# EAGLE design BTX (EAGLE 6.2)
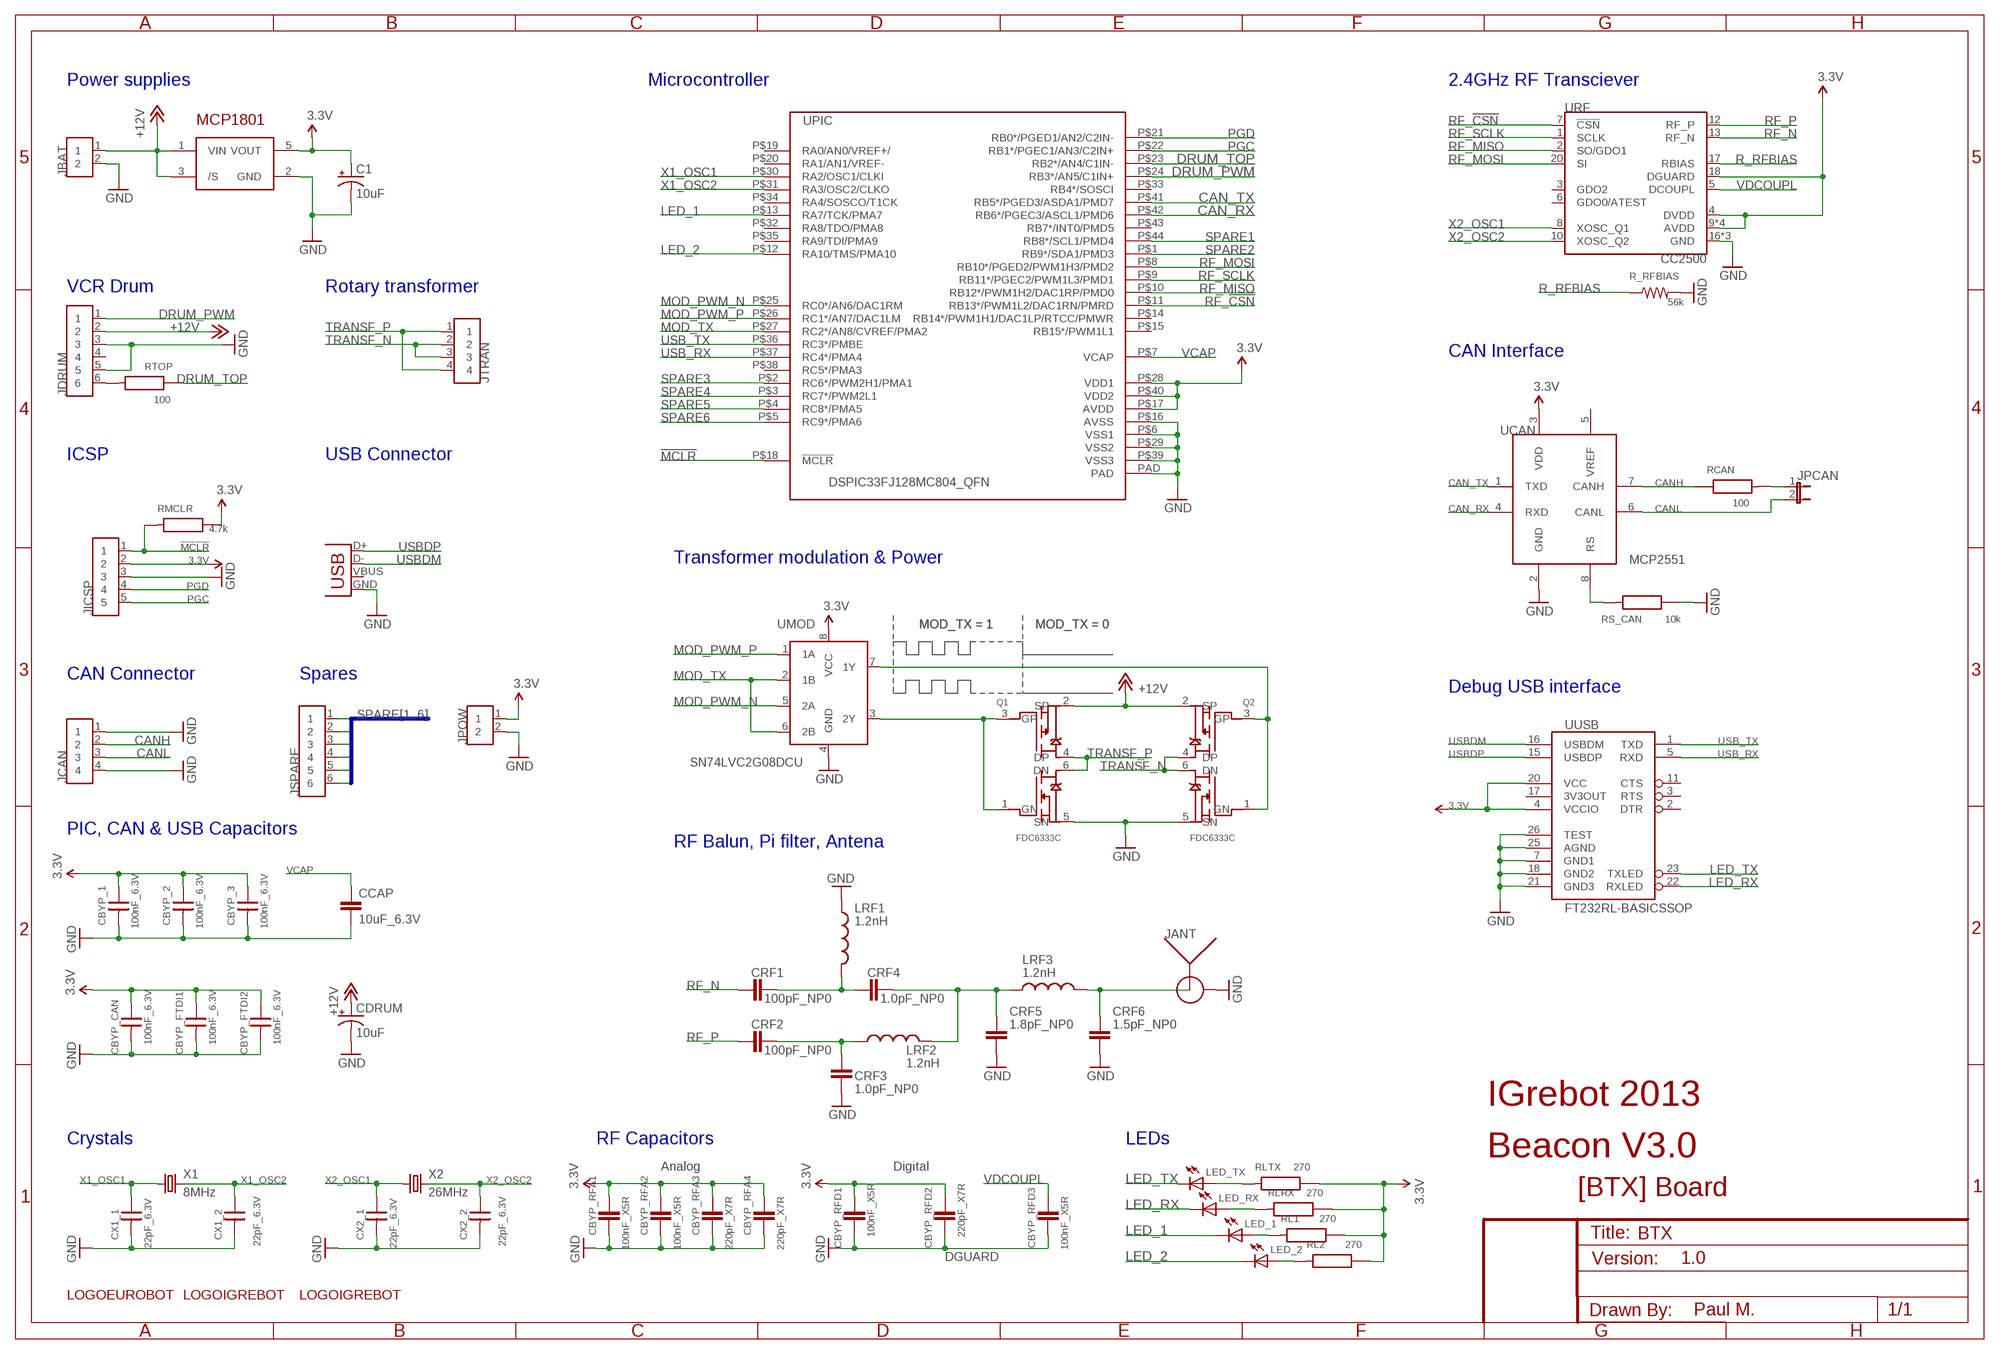
[diagram p0: schematic, sheet 1]

## Parts
C1  10uF  CAP_POLC  [PANASONIC_C]
CBYP_1  100nF_6.3V  C0603  [R0603]
CBYP_2  100nF_6.3V  C0603  [R0603]
CBYP_3  100nF_6.3V  C0603  [R0603]
CBYP_CAN  100nF_6.3V  C0603  [R0603]
CBYP_FTDI1  100nF_6.3V  C0603  [R0603]
CBYP_FTDI2  100nF_6.3V  C0603  [R0603]
CBYP_RFA1  100nF_X5R  CAP0402-CAP  [0402-CAP]
CBYP_RFA2  100nF_X5R  CAP0402-CAP  [0402-CAP]
CBYP_RFA3  220pF_X7R  CAP0402-CAP  [0402-CAP]
CBYP_RFA4  220pF_X7R  CAP0402-CAP  [0402-CAP]
CBYP_RFD1  100nF_X5R  CAP0402-CAP  [0402-CAP]
CBYP_RFD2  220pF_X7R  CAP0402-CAP  [0402-CAP]
CBYP_RFD3  100nF_X5R  CAP0402-CAP  [0402-CAP]
CCAP  10uF_6.3V  CAP1206  [1206]
CDRUM  10uF  CAP_POLC  [PANASONIC_C]
CRF1  100pF_NP0  CAP0402-CAP  [0402-CAP]
CRF2  100pF_NP0  CAP0402-CAP  [0402-CAP]
CRF3  1.0pF_NP0  CAP0402-CAP  [0402-CAP]
CRF4  1.0pF_NP0  CAP0402-CAP  [0402-CAP]
CRF5  1.8pF_NP0  CAP0402-CAP  [0402-CAP]
CRF6  1.5pF_NP0  CAP0402-CAP  [0402-CAP]
CX1_1  22pF_6.3V  C0603  [R0603]
CX1_2  22pF_6.3V  C0603  [R0603]
CX2_1  22pF_6.3V  C0603  [R0603]
CX2_2  22pF_6.3V  C0603  [R0603]
JANT  ENG_CD_1814400_C1  [SMA-PCB-ANGLE]
JBAT  MULTICOMP_PA001-2  [CON2-5.00]
JCAN  SIL4  [CON4-2.54]
JDRUM  SIL6  [CON6-2.54]
JICSP  SIL5  [CON5-2.54]
JPCAN  JUMPER-2PTH_LOCK  [1X02_LOCK]
JPOW  SIL2  [CON2-2.54]
JSPARE  SIL6  [CON6-2.54]
JTRAN  SIL4  [CON4-2.54]
JUSB  USBSMD  [USB-MINIB]
LED_1  LED0603  [LED-0603]
LED_2  LED0603  [LED-0603]
LED_RX  LED0603  [LED-0603]
LED_TX  LED0603  [LED-0603]
LRF1  1.2nH  INDUCTOR0402  [C0402]
LRF2  1.2nH  INDUCTOR0402  [C0402]
LRF3  1.2nH  INDUCTOR0402  [C0402]
Q1  FDC6333C  [SSOT6]
Q2  FDC6333C  [SSOT6]
R_RFBIAS  56k  RESISTOR0402-RES  [0402-RES]
RCAN  100  R0603  [R0603]
RL1  270  R0603  [R0603]
RL2  270  R0603  [R0603]
RLRX  270  R0603  [R0603]
RLTX  270  R0603  [R0603]
RMCLR  4.7k  R0603  [R0603]
RS_CAN  10k  R0603  [R0603]
RTOP  100  R0603  [R0603]
U$3  LOGOEUROBOT  [LOGO_EUROBOT_1]
U$5  LOGOIGREBOT  [LOGO_IGREBOT]
U$9  LOGOIGREBOT  [LOGO_IGREBOT]
UCAN  MCP2551  [SO-08]
UMOD  SN74LVC2G08DCU  [DCU8]
UPIC  DSPIC33FJ128MC804_QFN  [QFN44-8X8]
UREG  MCP1801  [SOT23-5L]
URF  CC2500  [QFN20-0.5]
UUSB  FT232RL-BASICSSOP  [SSOP28DB]
X1  8MHz  XTAL4.8_1.8  [XTAL_4.9-1.8]
X2  26MHz  XTAL4.8_1.8  [XTAL_4.9-1.8]

## Nets
3.3V: C1.+ CBYP_1.1 CBYP_2.1 CBYP_3.1 CBYP_CAN.1 CBYP_FTDI1.1 CBYP_FTDI2.1 CBYP_RFA1.2 CBYP_RFA2.2 CBYP_RFA3.2 CBYP_RFA4.2 CBYP_RFD1.2 CBYP_RFD2.2 JICSP.2 JPOW.1 RL1.1 RL2.1 RLRX.1 RLTX.1 RMCLR.1 UCAN.3(VDD) UMOD.8(VCC) UPIC.P$17(AVDD) UPIC.P$28(VDD1) UPIC.P$40(VDD2) UREG.5(VOUT) URF.4(DVDD) URF.9(AVDD) URF.11(AVDD) URF.14(AVDD) URF.15(AVDD) URF.18(DGUARD) UUSB.4(VCCIO) UUSB.20(VCC)
!MCLR!: JICSP.1 RMCLR.2 UPIC.P$18(!MCLR)
+12V: CDRUM.+ JBAT.1 JDRUM.2 Q1.2(SP) Q2.2(SP) UREG.1(VIN) UREG.3(/S)
CAN_RX: UCAN.4(RXD) UPIC.P$42(RB6*/PGEC3/ASCL1/PMD6)
CAN_TX: UCAN.1(TXD) UPIC.P$41(RB5*/PGED3/ASDA1/PMD7)
CANH: JCAN.2 RCAN.1 UCAN.7(CANH)
CANL: JCAN.3 JPCAN.2 UCAN.6(CANL)
DRUM_PWM: JDRUM.1 UPIC.P$24(RB3*/AN5/C1IN+)
DRUM_TOP: RTOP.1 UPIC.P$23(RB2*/AN4/C1IN-)
GND: C1.- CBYP_1.2 CBYP_2.2 CBYP_3.2 CBYP_CAN.2 CBYP_FTDI1.2 CBYP_FTDI2.2 CBYP_RFA1.1 CBYP_RFA2.1 CBYP_RFA3.1 CBYP_RFA4.1 CBYP_RFD1.1 CBYP_RFD2.1 CBYP_RFD3.1 CCAP.2 CDRUM.- CRF3.1 CRF5.1 CRF6.1 CX1_1.2 CX1_2.2 CX2_1.2 CX2_2.2 JANT.B1(B) JANT.B2(B) JANT.B3(B) JANT.B4(B) JBAT.2 JCAN.1 JCAN.4 JDRUM.3 JDRUM.5 JICSP.3 JPOW.2 JUSB.GND LRF1.1 Q1.5(SN) Q2.5(SN) R_RFBIAS.2 RS_CAN.1 UCAN.2(GND) UMOD.4(GND) UPIC.P$6(VSS1) UPIC.P$16(AVSS) UPIC.P$29(VSS2) UPIC.P$39(VSS3) UPIC.PAD UREG.2(GND) URF.16(GND) URF.19(GND) URF.PAD(GND) UUSB.7(GND1) UUSB.18(GND2) UUSB.21(GND3) UUSB.25(AGND) UUSB.26(TEST)
LED_1: LED_1.C UPIC.P$13(RA7/TCK/PMA7)
LED_2: LED_2.C UPIC.P$12(RA10/TMS/PMA10)
LED_RX: LED_RX.C UUSB.22(RXLED)
LED_TX: LED_TX.C UUSB.23(TXLED)
MOD_N: Q1.1(GN) Q1.3(GP) UMOD.3(2Y)
MOD_P: Q2.1(GN) Q2.3(GP) UMOD.7(1Y)
MOD_PWM_N: UMOD.5(2A) UPIC.P$25(RC0*/AN6/DAC1RM)
MOD_PWM_P: UMOD.1(1A) UPIC.P$26(RC1*/AN7/DAC1LM)
MOD_TX: UMOD.2(1B) UMOD.6(2B) UPIC.P$27(RC2*/AN8/CVREF/PMA2)
N$1: CRF1.2 CRF4.2 LRF1.2
N$2: LED_TX.A RLTX.2
N$3: CRF2.2 CRF3.2 LRF2.1
N$4: CRF4.1 CRF5.2 LRF2.2 LRF3.1
N$5: RS_CAN.2 UCAN.8(RS)
N$6: JPCAN.1 RCAN.2
N$7: CRF6.2 JANT.A LRF3.2
N$8: LED_RX.A RLRX.2
N$9: LED_1.A RL1.2
N$10: LED_2.A RL2.2
PGC: JICSP.5 UPIC.P$22(RB1*/PGEC1/AN3/C2IN+)
PGD: JICSP.4 UPIC.P$21(RB0*/PGED1/AN2/C2IN-)
R_RFBIAS: R_RFBIAS.1 URF.17(RBIAS)
RF_!CSN!: UPIC.P$11(RB13*/PWM1L2/DAC1RN/PMRD) URF.7(!CSN!)
RF_MISO: UPIC.P$10(RB12*/PWM1H2/DAC1RP/PMD0) URF.2(SO/GDO1)
RF_MOSI: UPIC.P$8(RB10*/PGED2/PWM1H3/PMD2) URF.20(SI)
RF_N: CRF1.1 URF.13(RF_N)
RF_P: CRF2.1 URF.12(RF_P)
RF_SCLK: UPIC.P$9(RB11*/PGEC2/PWM1L3/PMD1) URF.1(SCLK)
RTOP: JDRUM.6 RTOP.2
SPARE1: JSPARE.1 UPIC.P$44(RB8*/SCL1/PMD4)
SPARE2: JSPARE.2 UPIC.P$1(RB9*/SDA1/PMD3)
SPARE3: JSPARE.3 UPIC.P$2(RC6*/PWM2H1/PMA1)
SPARE4: JSPARE.4 UPIC.P$3(RC7*/PWM2L1)
SPARE5: JSPARE.5 UPIC.P$4(RC8*/PMA5)
SPARE6: JSPARE.6 UPIC.P$5(RC9*/PMA6)
TRANSF_N: JTRAN.2 JTRAN.3 Q2.4(DP) Q2.6(DN)
TRANSF_P: JTRAN.1 JTRAN.4 Q1.4(DP) Q1.6(DN)
USB_RX: UPIC.P$37(RC4*/PMA4) UUSB.5(RXD)
USB_TX: UPIC.P$36(RC3*/PMBE) UUSB.1(TXD)
USBDM: JUSB.D- UUSB.16(USBDM)
USBDP: JUSB.D+ UUSB.15(USBDP)
VCAP: CCAP.1 UPIC.P$7(VCAP)
VDCOUPL: CBYP_RFD3.2 URF.5(DCOUPL)
X1_OSC1: CX1_1.1 UPIC.P$30(RA2/OSC1/CLKI) X1.P$1
X1_OSC2: CX1_2.1 UPIC.P$31(RA3/OSC2/CLKO) X1.P$2
X2_OSC1: CX2_1.1 URF.8(XOSC_Q1) X2.P$1
X2_OSC2: CX2_2.1 URF.10(XOSC_Q2) X2.P$2
Unconnected: JDRUM.4 JUSB.VBUS UCAN.5(VREF) UPIC.P$14(RB14*/PWM1H1/DAC1LP/RTCC/PMWR) UPIC.P$15(RB15*/PWM1L1) UPIC.P$19(RA0/AN0/VREF+/) UPIC.P$20(RA1/AN1/VREF-) UPIC.P$32(RA8/TDO/PMA8) UPIC.P$33(RB4*/SOSCI) UPIC.P$34(RA4/SOSCO/T1CK) UPIC.P$35(RA9/TDI/PMA9) UPIC.P$38(RC5*/PMA3) UPIC.P$43(RB7*/INT0/PMD5) URF.3(GDO2) URF.6(GDO0/ATEST) UUSB.2(DTR) UUSB.3(RTS) UUSB.11(CTS) UUSB.17(3V3OUT)

## Buses
SPARE[1..6]

## Notes on the sheet
- Power supplies | Microcontroller | 2.4GHz RF Transciever
- VCR Drum | Rotary transformer
- CAN Interface
- ICSP | USB Connector
- Transformer modulation & Power
- MOD_TX = 1 | MOD_TX = 1 | MOD_TX = 0 | MOD_TX = 0
- CAN Connector | Spares
- Debug USB interface
- PIC, CAN & USB Capacitors
- RF Balun, Pi filter, Antena
- IGrebot 2013
- Crystals | RF Capacitors | LEDs
- Beacon V3.0
- Analog | Digital
- [BTX] Board
- DGUARD | 1.0
- Paul M.

## Library data of the parts
C1 CDRUM = SparkFun-Passives:CAP_POL: Capacitor Polarized These are standard SMD and PTH capacitors. Normally 10uF, 47uF, and 100uF in electrolytic and tantalum varieties. Always verify the external diameter of the through hole cap, it varies with capacity, voltage, and manufacturer. The EIA devices should be standard.
CBYP_1-CBYP_3 CBYP_CAN CBYP_FTDI1 CBYP_FTDI2 CX1_1 CX1_2 CX2_1 CX2_2 = 0SBLib:C
CBYP_RFA1-CBYP_RFA4 CBYP_RFD1-CBYP_RFD3 CRF1-CRF6 = SparkFun-Passives:CAP: Capacitor Standard 0603 ceramic capacitor, and 0.1" leaded capacitor.
CCAP = SparkFun:CAP: Capacitor Standard 0603 ceramic capacitor, and 0.1" leaded capacitor.
JANT = lib_paul_v6:ENG_CD_1814400_C1
JBAT = lib_paul_v6:MULTICOMP_PA001-2
JCAN JTRAN = lib_paul_v6:SIL4
JDRUM JSPARE = lib_paul_v6:SIL6
JICSP = lib_paul_v6:SIL5
JPCAN = SparkFun-Passives:JUMPER-2: Jumper Basic 0.1" spaced jumper. Use with breakaway headers.
JPOW = lib_paul_v6:SIL2
JUSB = SparkFun:USB: USB Connectors USB-B-PTH is fully proven SKU : PRT-00139 USB-miniB is fully proven SKU : PRT-00587 USB-A-PCB is untested. USB-A-H is throughly reviewed, but untested. Spark Fun Electronics SKU : PRT-00437 USB-B-SMT is throughly reviewed, but untested. Needs silkscreen touching up. USB-A-S has not been used/tested USB-MB-H has not been used/tested
LED_1 LED_2 LED_RX LED_TX = SparkFun:LED: LEDs Standard schematic elements and footprints for 5mm, 3mm, 1206, and 0603 sized LEDs. 5mm - Spark Fun Electronics SKU : COM-00529 (and others)
LRF1-LRF3 = SparkFun-Passives:INDUCTOR: Inductors Basic Inductor/Choke - 0603 and 1206. Footprints are not proven and vary greatly between part numbers.
Q1 Q2 = lib_paul_v6:FDC6333C
R_RFBIAS = SparkFun-Passives:RESISTOR: Resistor Basic schematic elements and footprints for 0603, 1206, and PTH resistors.
RCAN RL1 RL2 RLRX RLTX RMCLR RS_CAN RTOP = 0SBLib:R
U$3 U$5 U$9 = 0SBLib:LOGO
UCAN = 0SBLib:MCP2551: High-Speed CAN Transceiver
UMOD = lib_paul_v6:SN74LVC2G08DCU
UPIC = 0SBLib:DSPIC33FJ128MC804: High-Performance,16-bit Digital Signal Controller
UREG = 0SBLib:MCP1801
URF = lib_paul_v6:CC2500
UUSB = SparkFun:FT232RL-BASIC: USB UART This is the simplified version of the FT232RL unit. Only what you need, nothing you don't. Spark Fun Electronics SKU : COM-00650
X1 X2 = 0SBLib:XTAL

## Board
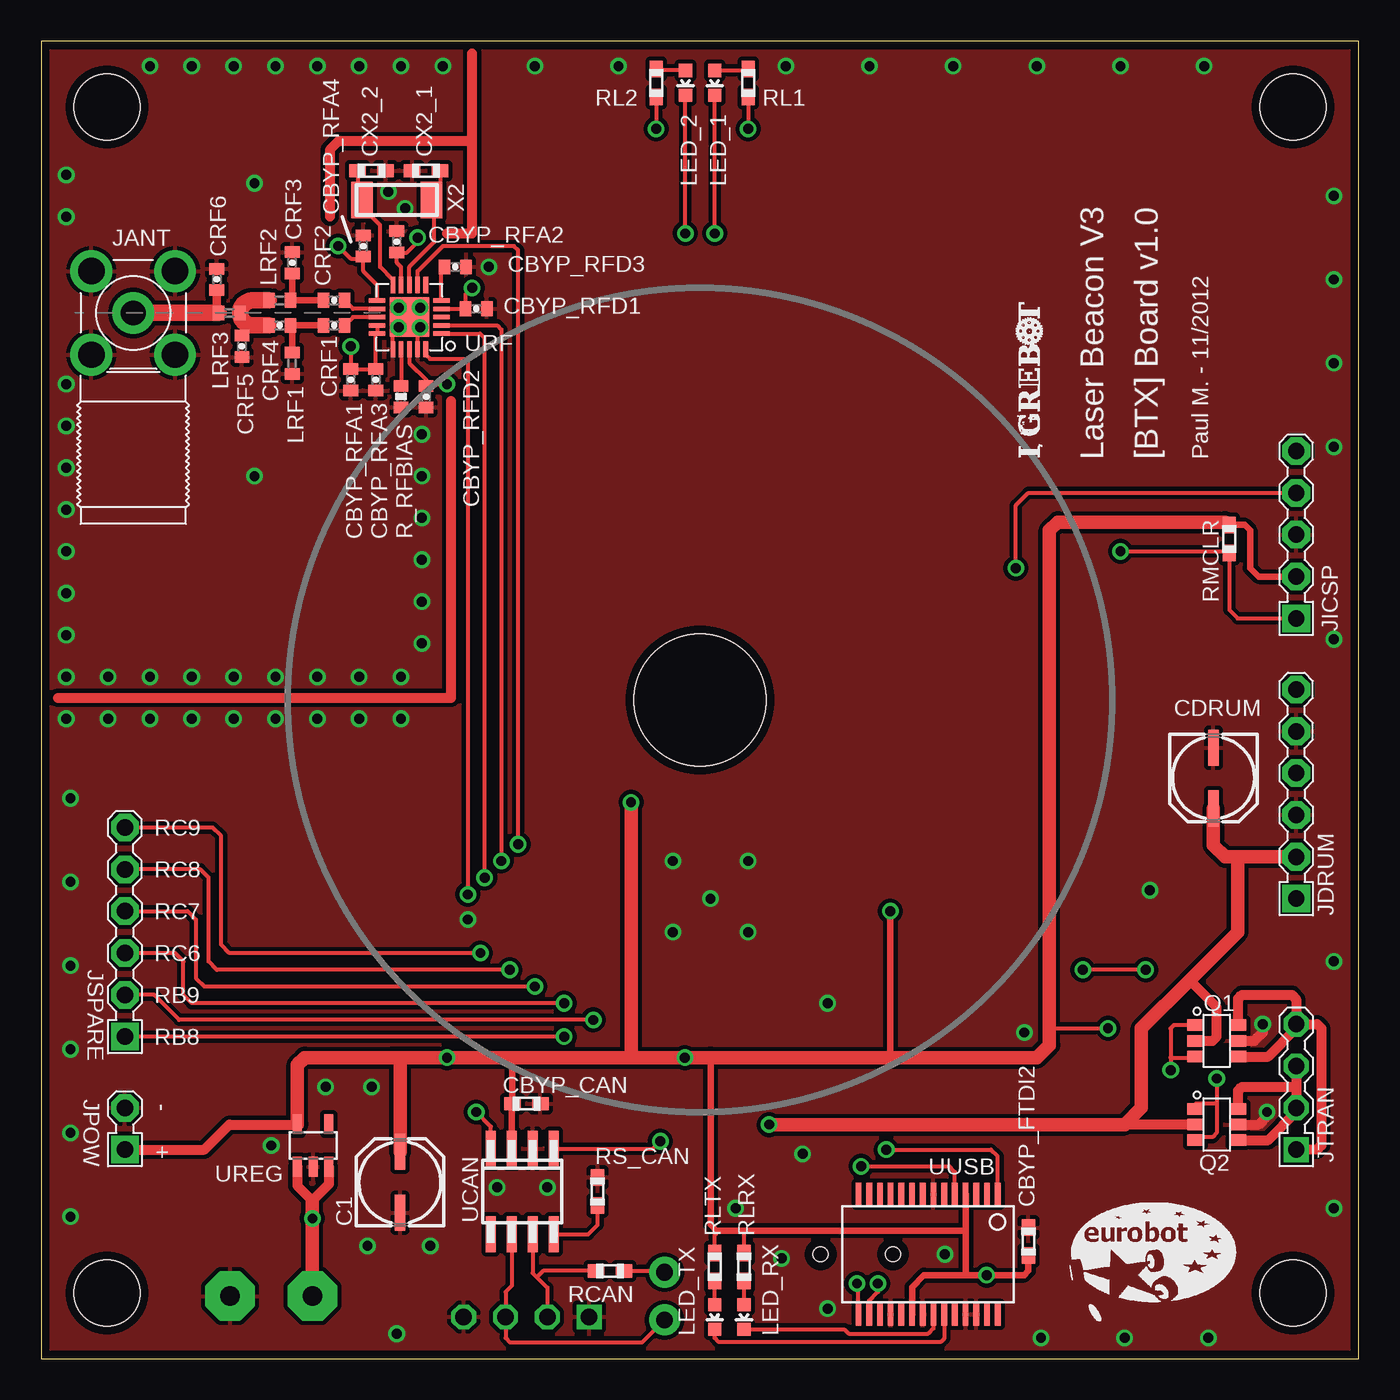
[diagram p1: board, top side]
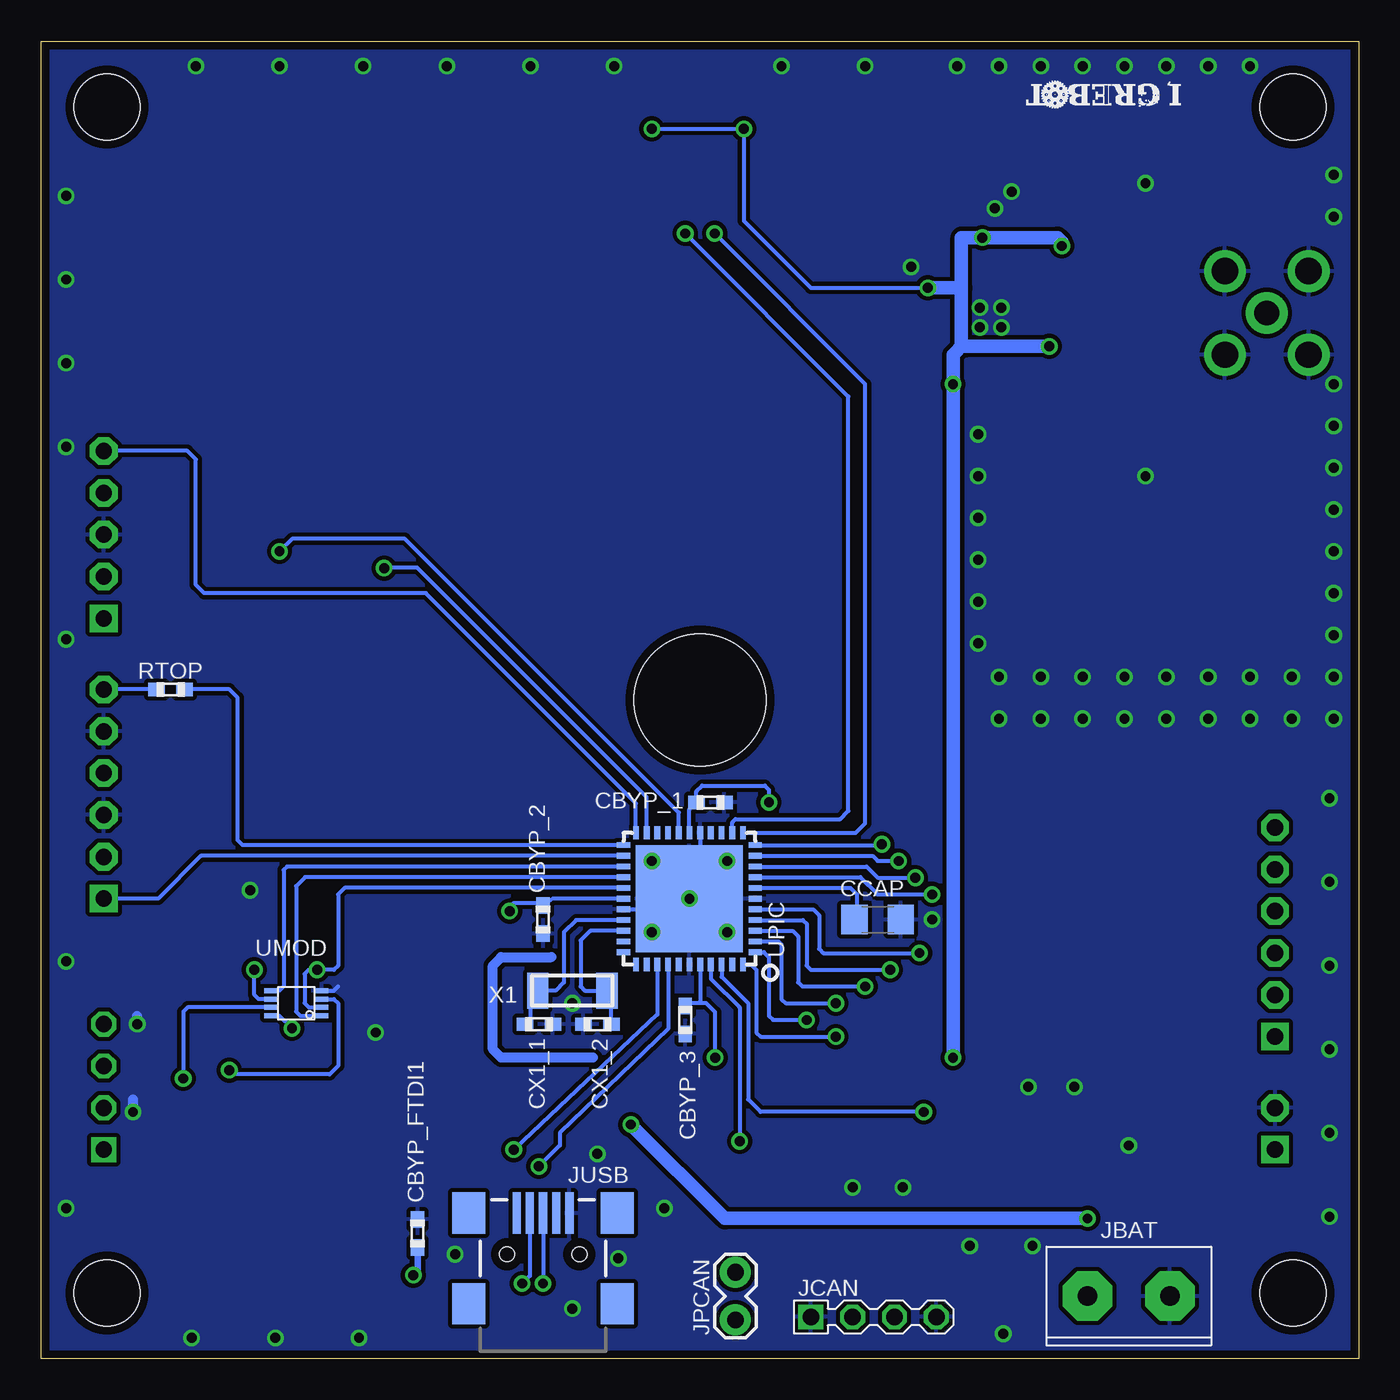
[diagram p2: board, bottom side, seen from below]

Size 80 x 80 mm. Coordinates in mm from the lower left corner, seen from the top.
Outline: 0,0 80,0 80,80 0,80 0,0
Copper layers (1*16): Top 0.035mm / dielectric 1.5mm / Bottom 0.035mm
Design rules: minimum track width 10mil, minimum drill 0.6mm, track to track 8mil, track to pad 8mil, pad to pad 7.5mil, via to via 8mil, smd to smd 7.5mil, copper to edge 20mil, drill to drill 8mil, minimum pad ring 10mil, minimum via ring 8mil, stop-mask expansion 4mil, vias tented up to drill 0mil, thermal gap 10mil
Holes 4 mm at 4,4 4,76 76,76 76,4
Holes 8 mm at 40,40

### Footprints (pad centres in the part's own frame; a part is rotated, then mirrored left to right if it is on the bottom)
PANASONIC_C = smd 2.2 x 0.65: + 1.9,-0.2; - -1.8,-0.2
R0603 = smd 1 x 0.8: 1 -0.85,0; 2 0.85,0
0402-CAP = smd 0.7 x 0.9: 1 -0.65,0; 2 0.65,0
1206 = smd 1.6 x 1.8: 1 -1.4,0; 2 1.4,0
SMA-PCB-ANGLE = drill 1.5 pad 2.54: A 0,0 | drill 1.6 pad 2.54: B1 -2.54,2.54; B2 2.54,2.54; B3 2.54,-2.54; B4 -2.54,-2.54
CON2-5.00 = drill 1.2 pad 3 octagon: 1 -2.5,0; 2 2.5,0
CON4-2.54 = drill 1 square: 1 -3.81,0 | drill 1 octagon: 2 -1.27,0; 3 1.27,0; 4 3.81,0
CON6-2.54 = drill 1 pad 1.676 square: 1 -6.35,0 | drill 1 pad 1.676 octagon: 2 -3.81,0; 3 -1.27,0; 4 1.27,0; 5 3.81,0; 6 6.35,0
CON5-2.54 = drill 1 pad 1.676 square: 1 -5.08,0 | drill 1 pad 1.676 octagon: 2 -2.54,0; 3 0,0; 4 2.54,0; 5 5.08,0
1X02_LOCK = drill 1.016 pad 1.88: 1 -0.178,0; 2 2.718,0
CON2-2.54 = drill 1 pad 1.676 square: 1 -1.27,0 | drill 1 pad 1.676 octagon: 2 1.27,0
USB-MINIB = smd 2.5 x 0.5: D+ 2.5,0; D- 2.5,0.8; GND 2.5,-1.6; ID 2.5,-0.8; VBUS 2.5,1.6 | smd 2.5 x 2: MTN1 -3,4.5; MTN2 2.5,4.5; MTN3 -3,-4.5; MTN4 2.5,-4.5 | hole 0.9: 0,2.2; 0,-2.2
LED-0603 = smd 0.8 x 0.8: A 0,-0.75; C 0,0.75
C0402 = smd 0.7 x 0.9: 1 -0.65,0; 2 0.65,0
SSOT6 = smd 0.7 x 1: 1 -0.95,-1.3; 2 0,-1.3; 3 0.95,-1.3; 4 0.95,1.3; 5 0,1.3; 6 -0.95,1.3
0402-RES = smd 0.7 x 0.9: 1 -0.65,0; 2 0.65,0
SO-08 = smd 0.6 x 2.2: 1 -1.905,-2.6; 2 -0.635,-2.6; 3 0.635,-2.6; 4 1.905,-2.6; 5 1.905,2.6; 6 0.635,2.6; 7 -0.635,2.6; 8 -1.905,2.6
DCU8 = smd 0.3 x 0.8: 1 -0.75,-1.55; 2 -0.25,-1.55; 3 0.25,-1.55; 4 0.75,-1.55; 5 0.75,1.55; 6 0.25,1.55; 7 -0.25,1.55; 8 -0.75,1.55
QFN44-8X8 = smd 0.8 x 0.35: P$1 -4,3.25; P$2 -4,2.6; P$3 -4,1.95; P$4 -4,1.3; P$5 -4,0.65; P$6 -4,0; P$7 -4,-0.65; P$8 -4,-1.3; P$9 -4,-1.95; P$10 -4,-2.6; P$11 -4,-3.25; P$23 4,-3.25; P$24 4,-2.6; P$25 4,-1.95; P$26 4,-1.3; P$27 4,-0.65; P$28 4,0; P$29 4,0.65; P$30 4,1.3; P$31 4,1.95; P$32 4,2.6; P$33 4,3.25 | smd 0.35 x 0.8: P$12 -3.25,-4; P$13 -2.6,-4; P$14 -1.95,-4; P$15 -1.3,-4; P$16 -0.65,-4; P$17 0,-4; P$18 0.65,-4; P$19 1.3,-4; P$20 1.95,-4; P$21 2.6,-4; P$22 3.25,-4; P$34 3.25,4; P$35 2.6,4; P$36 1.95,4; P$37 1.3,4; P$38 0.65,4; P$39 0,4; P$40 -0.65,4; P$41 -1.3,4; P$42 -1.95,4; P$43 -2.6,4; P$44 -3.25,4 | smd 6.5 x 6.5: PAD 0,0
SOT23-5L = smd 0.55 x 1.2: 1 -0.95,-1.3; 2 0,-1.3; 3 0.95,-1.3; 4 0.95,1.3; 5 -0.95,1.3
QFN20-0.5 = smd 0.28 x 1: 1 -1,-1.95; 2 -0.5,-1.95; 3 0,-1.95; 4 0.5,-1.95; 5 1,-1.95; 11 1,1.95; 12 0.5,1.95; 13 0,1.95; 14 -0.5,1.95; 15 -1,1.95 | smd 1 x 0.28: 6 1.95,-1; 7 1.95,-0.5; 8 1.95,0; 9 1.95,0.5; 10 1.95,1; 16 -1.95,1; 17 -1.95,0.5; 18 -1.95,0; 19 -1.95,-0.5; 20 -1.95,-1 | smd 2.4 x 2.4: PAD 0,0
SSOP28DB = smd 0.348 x 1.397: 1 -4.225,-3.656; 2 -3.575,-3.656; 3 -2.925,-3.656; 4 -2.275,-3.656; 5 -1.625,-3.656; 6 -0.975,-3.656; 7 -0.325,-3.656; 8 0.325,-3.656; 9 0.975,-3.656; 10 1.625,-3.656; 11 2.275,-3.656; 12 2.925,-3.656; 13 3.575,-3.656; 14 4.225,-3.656; 15 4.225,3.656; 16 3.575,3.656; 17 2.925,3.656; 18 2.275,3.656; 19 1.625,3.656; 20 0.975,3.656; 21 0.325,3.656; 22 -0.325,3.656; 23 -0.975,3.656; 24 -1.625,3.656; 25 -2.275,3.656; 26 -2.925,3.656; 27 -3.575,3.656; 28 -4.225,3.656
XTAL_4.9-1.8 = smd 1.3 x 2.2: P$1 -2.1,0; P$2 2.1,0

### Placement (x,y rotation side)
C1  21.59,10.67 90 top
CBYP_1  39.37,33.78 0 bottom
CBYP_2  49.53,26.67 270 bottom
CBYP_3  40.89,20.57 270 bottom
CBYP_CAN  29.46,15.49 0 top
CBYP_FTDI1  57.15,7.62 90 bottom
CBYP_FTDI2  59.94,7.11 90 top
CBYP_RFA1  18.8,59.44 90 top
CBYP_RFA2  21.59,67.82 270 top
CBYP_RFA3  20.32,59.44 90 top
CBYP_RFA4  19.56,67.56 270 top
CBYP_RFD1  26.42,63.75 180 top
CBYP_RFD2  23.37,58.42 90 top
CBYP_RFD3  25.15,66.29 180 top
CCAP  29.21,26.67 0 bottom
CDRUM  71.37,35.31 270 top
CRF1  17.78,62.74 180 top
CRF2  17.78,64.26 180 top
CRF3  15.24,66.55 270 top
CRF4  14.48,62.74 0 top
CRF5  12.19,61.47 90 top
CRF6  10.67,65.53 270 top
CX1_1  49.78,20.32 0 bottom
CX1_2  46.23,20.32 180 bottom
CX2_1  23.37,72.14 180 top
CX2_2  20.07,72.14 0 top
JANT  5.59,63.5 270 top
JBAT  13.97,3.81 0 bottom
JCAN  29.46,2.54 0 bottom
JDRUM  76.2,34.29 90 top
JICSP  76.2,50.04 90 top
JPCAN  37.85,5.08 270 bottom
JPOW  5.08,13.97 90 top
JSPARE  5.08,25.91 90 top
JTRAN  76.2,16.51 90 top
JUSB  49.53,6.35 90 bottom
LED_1  40.89,77.47 180 top
LED_2  39.12,77.47 180 top
LED_RX  42.67,2.54 180 top
LED_TX  40.89,2.54 180 top
LRF1  15.24,60.45 90 top
LRF2  14.48,64.26 180 top
LRF3  11.43,63.5 180 top
Q1  71.37,19.3 270 top
Q2  71.37,14.22 270 top
R_RFBIAS  21.84,58.42 270 top
RCAN  34.54,5.33 0 top
RL1  42.93,77.47 90 top
RL2  37.34,77.47 90 top
RLRX  42.67,5.59 270 top
RLTX  40.89,5.59 270 top
RMCLR  72.14,49.78 270 top
RS_CAN  33.78,10.16 270 top
RTOP  72.14,40.64 180 bottom
U$3  61.98,1.78 0 top
U$5  60.96,54.61 90 top
U$9  10.67,77.72 180 bottom
UCAN  29.21,10.16 180 top
UMOD  64.52,21.59 90 bottom
UPIC  40.64,27.94 180 bottom
UREG  16.51,12.95 0 top
URF  22.35,63.25 90 top
UUSB  53.85,6.35 180 top
X1  47.75,22.35 0 bottom
X2  21.59,70.36 180 top

### Tracks (layer width: path | path; a pad name or v marks a point on that pad's centre or on a via)
3.3V  (via drill 0.6)
  Top 0.254: URF.9 21.85,66.29 21.59,66.55 CBYP_RFA2.2 22.21,67.17 22.86,67.82 v22.86,68.07 | URF.18 22.35,60.45 23.37,59.44 23.37,59.18 | 23.37,59.18 CBYP_RFD2.2 | URF.14 URF.15 20.32,62.16 CBYP_RFA3.2 CBYP_RFA1.2 v18.8,61.47 | v18.03,67.56 18.8,66.8 19.7,66.8 CBYP_RFA4.2 19.56,66.04 20.4,65.2 URF.11 | 23.37,59.18 v24.64,59.18 | RL1.1 v42.93,74.68 | RL2.1 v37.34,74.68 | RLTX.1 40.89,7.52 41.15,7.77 | RLRX.1 42.67,7.77 | 61.21,20.07 v64.77,20.07 | 51.54,27.15 v51.56,27.18 | URF.4 25.76,63.75 CBYP_RFD1.2 25.77,64.63 v26.16,65.02
  Top 0.406: UCAN.3 28.57,15.46 CBYP_CAN.1 28.61,18.12 28.45,18.29 | UUSB.20 52.87,4.36 53.59,5.08 56.13,5.08 | UUSB.4 56.12,7.77 | 56.12,7.77 56.12,5.09 56.13,5.08 | 56.13,5.08 v57.4,5.08 59.69,5.08 59.94,5.33 CBYP_FTDI2.1 | 56.12,7.77 42.67,7.77 41.15,7.77 41,7.77 40.64,8.13 40.64,18.29 | 51.54,27.15 51.54,18.32 51.56,18.29 | v35.81,33.78 | RMCLR.1 73.06,50.63 73.41,50.29 73.41,48.01 73.91,47.5 JICSP.2
  Top 0.61: JPOW.1 9.91,12.7 11.43,14.22 15.53,14.22 UREG.5
  Top 0.813: 35.81,18.29 28.45,18.29 v24.64,18.29 21.59,18.29 | 35.81,18.29 v39.08,18.29 40.64,18.29 51.56,18.29 60.45,18.29 61.21,19.05 61.21,20.07 61.21,50.29 61.72,50.8 71.88,50.8 72.05,50.71 RMCLR.1 | 35.81,18.29 v35.81,33.78 | UREG.5 15.56,17.85 16,18.29 21.34,18.29 | 21.34,18.29 21.59,18.29 | C1.+ 21.79,18.09 21.59,18.29 | 21.34,18.29
  Bottom 0.254: UPIC.P$28 48.93,27.94 CBYP_2.1 49.7,27.69 51.31,27.69 51.56,27.43 v51.56,27.18 | v42.93,74.68 v37.34,74.68 37.34,69.09 33.27,65.02 v26.16,65.02 | v64.77,20.07 65.53,20.83 66.05,20.83 UMOD.8 | v39.08,18.29 39.08,21.05 39.62,21.59 39.88,21.59 | 39.88,21.59 40.73,21.59 CBYP_3.1 | UPIC.P$40 39.99,21.7 39.88,21.59 | UPIC.P$17 40.64,33.36 CBYP_1.1 40.22,34.46 39.88,34.8 36.07,34.8 35.81,34.54 v35.81,33.78
  Bottom 0.406: 23.88,61.47 24,61.59 24.13,61.72 | CBYP_FTDI1.1 57.15,5.33 v57.4,5.08
  Bottom 0.813: v18.03,67.56 18.03,67.82 18.29,68.07 v22.86,68.07 24.13,68.07 24.13,65.02 | v18.8,61.47 23.88,61.47 | 24.13,61.72 24.13,65.02 | v24.64,59.18 24.64,60.96 24,61.59 | v26.16,65.02 24.13,65.02 | v24.64,59.18 | v24.64,59.18 v24.64,18.29
!MCLR!  (via drill 0.6)
  Top 0.254: v65.53,49.02 72.05,49.02 RMCLR.2 72.14,45.47 72.64,44.96 JICSP.1
  Bottom 0.254: UPIC.P$18 41.29,33.16 57.91,49.78 64.77,49.78 v65.53,49.02
+12V  (via drill 0.6)
  Top 0.508: 66.87,18.22 66.8,18.29
  Top 0.61: UREG.1 15.56,10.52 16.47,9.61 17.46,10.6 UREG.3 | Q1.2 71.12,19.3 71.37,19.56 71.37,21.34 69.72,22.99 | Q2.2 65.79,14.22
  Top 0.813: JBAT.1 v16.47,8.52 16.47,9.61 | v44.2,14.22 65.79,14.22 66.8,15.24 66.8,18.29 66.8,20.07 69.72,22.99 72.64,25.91 72.64,30.48 | 72.64,30.48 JDRUM.2 | CDRUM.+ 71.17,31.19 71.88,30.48 72.64,30.48
  Bottom 0.813: v16.47,8.52 38.49,8.52 v44.2,14.22
CAN_RX  (via drill 0.6)
  Top 0.254: UCAN.4 27.3,14.1 v26.42,14.99
  Bottom 0.254: UPIC.P$42 38.69,23.2 37.08,21.59 37.08,15.75 36.32,14.99 v26.42,14.99
CAN_TX  (via drill 0.6)
  Top 0.254: UCAN.1 37.14,12.76 v37.59,13.21
  Bottom 0.254: UPIC.P$41 39.34,23.08 37.59,21.34 v37.59,13.21
CANH
  Top 0.254: UCAN.7 29.84,5.21 30.1,4.95 | 30.1,4.95 30.73,4.32 JCAN.2 | RCAN.1 30.48,5.33 30.1,4.95
CANL
  Top 0.254: UCAN.6 28.57,4.45 28.19,4.06 JCAN.3 28.19,1.27 28.45,1.02 36.5,1.02 JPCAN.2
DRUM_PWM
  Bottom 0.254: UPIC.P$24 70.3,30.54 72.9,27.94 JDRUM.1
DRUM_TOP
  Bottom 0.254: UPIC.P$23 67.77,31.19 68.07,31.5 68.07,40.13 68.58,40.64 RTOP.1
GND  (via drill 0.6)
  Top 0.254: URF.19 22.85,62.47 v23.01,62.63 | URF.16 21.35,62.27 v21.71,62.63
  Top 0.61: Q2.5 73.91,14.22 74.42,14.73 v74.42,14.99 | Q1.5 73.66,19.3 74.17,19.81 v74.17,20.32
  Bottom 0.254: UPIC.P$29 43.32,27.29 | 43.32,27.29 43.18,27.43 | UPIC.P$16 39.99,30.59 39.62,30.23 v38.35,30.23 | 43.32,27.29 43.32,27.07 42.93,26.67 v42.93,25.91 | UMOD.4 62.24,22.34 61.98,22.61
  Bottom 0.61: v74.42,14.99 74.42,15.75 | v74.17,20.32 74.17,20.83
  other vias: 21.71,63.83 23.01,63.83 27.18,66.29 21.08,70.87 22.1,69.85 1.52,41.4 4.06,41.4 6.6,41.4 9.14,41.4 11.68,41.4 14.22,41.4 16.76,41.4 19.3,41.4 21.84,41.4 1.52,38.86 4.06,38.86 6.6,38.86 9.14,38.86 11.68,38.86 14.22,38.86 16.76,38.86 19.3,38.86 21.84,38.86 1.52,43.94 1.52,46.48 1.52,49.02 1.52,51.56 1.52,54.1 1.52,56.64 1.52,59.18 1.52,69.34 1.52,71.88 6.6,78.49 9.14,78.49 11.68,78.49 14.22,78.49 16.76,78.49 19.3,78.49 21.84,78.49 24.38,78.49 23.11,43.43 23.11,45.97 23.11,48.51 23.11,51.05 23.11,53.59 23.11,56.13 12.95,53.59 12.95,71.37 42.93,30.23 38.35,25.91 40.64,27.94 47.75,21.59 60.71,1.27 65.79,1.27 70.87,1.27 78.49,9.14 78.49,24.13 67.31,28.45 78.49,43.69 78.49,55.37 78.49,60.45 78.49,65.53 78.49,70.61 70.61,78.49 21.59,1.52 1.78,8.64 1.78,13.72 1.78,18.8 1.78,23.88 1.78,28.96 1.78,34.04 65.53,78.49 60.45,78.49 55.37,78.49 50.29,78.49 45.21,78.49 35.05,78.49 29.97,78.49 25.91,26.67 54.86,6.35 47.75,3.05 44.96,6.1 42.16,9.14 46.23,12.45 27.69,10.41 30.73,10.41 13.97,12.95 17.27,16.51 20.07,16.51 19.81,6.86 23.62,6.86 59.69,19.81
  pour Bottom (isolate 0.254): 0,80.01 80.01,80.01 80.01,0 0,0
  pour Top (isolate 0.254, rank 4): 0,80.01 80.01,80.01 80.01,0 0,0
LED_1  (via drill 0.6)
  Top 0.254: v40.89,68.33 LED_1.C
  Bottom 0.254: UPIC.P$13 38.04,32.57 37.85,32.77 31.5,32.77 30.99,33.27 30.99,58.42 v40.89,68.33
LED_2  (via drill 0.6)
  Top 0.254: v39.12,68.33 LED_2.C
  Bottom 0.254: UPIC.P$12 30.54,31.94 29.97,32.51 29.97,59.18 v39.12,68.33
LED_RX
  Top 0.254: LED_RX.C 48.76,1.79 49.02,1.52 53.85,1.52 54.17,1.85 UUSB.22
LED_TX
  Top 0.254: UUSB.23 54.82,1.23 54.61,1.02 41.15,1.02 40.89,1.27 LED_TX.C
MOD_N  (via drill 0.6)
  Top 0.254: 68.58,18.29 70.01,18.29 Q1.3 | Q1.1 68.77,20.25 68.58,20.07 68.58,18.29 | 68.58,18.29 v68.58,17.53
  Bottom 0.254: UMOD.3 62.23,21.84 61.98,21.59 61.98,17.78 62.48,17.27 68.33,17.27 v68.58,17.53
MOD_P  (via drill 0.6)
  Top 0.254: v71.37,17.02 71.37,15.49 | 71.37,15.49 71.37,13.72 71.12,13.46 70.14,13.46 Q2.3 | 71.37,15.49 70.14,15.49 | 70.1,15.49 70.14,15.49 | 70.14,15.49 Q2.1
  Bottom 0.254: UMOD.7 71.12,21.34 71.37,21.08 v71.37,17.02
MOD_PWM_N
  Bottom 0.254: UPIC.P$25 65.07,29.89 65.28,29.69 65.28,22.61 65.53,22.35 66.05,22.35 UMOD.5
MOD_PWM_P
  Bottom 0.254: UPIC.P$26 63.98,29.24 64.52,28.7 64.52,21.08 64.26,20.83 62.98,20.83 UMOD.1
MOD_TX  (via drill 0.6)
  Top 0.254: v67.06,23.62 v63.25,23.62
  Bottom 0.254: UPIC.P$27 61.58,28.59 61.98,28.19 61.98,23.88 62.23,23.62 v63.25,23.62 63.75,23.62 64.01,23.37 64.01,21.59 63.75,21.34 UMOD.2 | UMOD.6 66.8,21.84 67.06,22.1 v67.06,23.62
N$1
  Top 0.406: CRF1.2 CRF4.2 15.24,62.74 LRF1.2
N$2
  Top 0.254: LED_TX.A RLTX.2
N$3
  Top 0.406: CRF2.2 LRF2.1 15.24,64.26 CRF3.2
N$4
  Top 0.254: CRF5.2 arc-90 12.81,62.74 12.84,62.74
  Top 1.016: CRF4.1 12.84,62.74 arc-90 LRF3.1 arc-90 12.84,64.26 LRF2.2
N$5
  Top 0.254: UCAN.8 33.21,7.56 33.78,8.13 RS_CAN.2
N$6
  Top 0.254: RCAN.2 37.77,5.33 JPCAN.1
N$7
  Top 0.508: LRF3.2 arc-90 10.67,63.61 CRF6.2
  Top 1.016: JANT.A LRF3.2
N$8
  Top 0.254: LED_RX.A RLRX.2
N$9
  Top 0.254: LED_1.A 42.83,78.22 RL1.2
N$10
  Top 0.254: LED_2.A 37.44,78.22 RL2.2
N$14
  Bottom 0.61: 46.48,18.29 52.07,18.29 52.58,18.8 52.58,23.88 52.07,24.38 49.02,24.38
PGC
  Bottom 0.254: UPIC.P$22 43.89,33.73 56.64,46.48 70.1,46.48 70.61,46.99 70.61,54.61 71.12,55.12 JICSP.5
PGD  (via drill 0.6)
  Top 0.254: v59.18,48.01 59.18,51.82 59.94,52.58 JICSP.4
  Bottom 0.254: UPIC.P$21 43.24,34.1 57.17,48.03 59.16,48.03 v59.18,48.01
R_RFBIAS
  Top 0.254: URF.17 21.85,59.08 R_RFBIAS.1
RF_!CSN!  (via drill 0.6)
  Top 0.254: URF.7 22.85,66.03 24.38,67.56 28.7,67.56 28.96,67.31 v28.96,31.24
  Bottom 0.254: UPIC.P$11 29.01,31.19 v28.96,31.24
RF_MISO  (via drill 0.6)
  Top 0.254: URF.2 27.68,62.75 27.94,62.48 v27.94,30.23
  Bottom 0.254: UPIC.P$10 29.52,30.54 29.21,30.23 v27.94,30.23
RF_MOSI  (via drill 0.6)
  Top 0.254: URF.20 23.35,60.98 23.62,60.71 25.65,60.71 25.91,60.45 v25.91,28.19
  Bottom 0.254: UPIC.P$8 30.26,29.24 29.21,28.19 v25.91,28.19
RF_N
  Top 0.254: URF.13 18.94,63.25 CRF1.1
RF_P
  Top 0.254: URF.12 18.95,63.75 CRF2.1
RF_SCLK  (via drill 0.6)
  Top 0.254: v26.92,29.21 26.92,61.98 26.65,62.25 URF.1
  Bottom 0.254: UPIC.P$9 29.89,29.89 29.21,29.21 v26.92,29.21
RTOP
  Bottom 0.254: RTOP.2 JDRUM.6
SHIELD
  Top 0.61: 26.16,73.91 18.03,73.91 17.53,73.41 17.53,69.34 | 26.16,73.91 26.16,68.33 24.64,68.33 | 26.16,73.91 26.16,79.25
SHIELD2
  Top 0.61: 1.02,40.13 24.89,40.13 24.89,58.17
SPARE1  (via drill 0.6)
  Top 0.254: v31.75,19.56 JSPARE.1
  Bottom 0.254: UPIC.P$44 36.89,23.94 36.58,23.62 36.58,19.81 36.32,19.56 v31.75,19.56
SPARE2  (via drill 0.6)
  Top 0.254: v33.53,20.57 8.38,20.57 6.86,22.1 JSPARE.2
  Bottom 0.254: UPIC.P$1 36.12,24.69 35.81,24.38 35.81,20.83 35.56,20.57 v33.53,20.57
SPARE3  (via drill 0.6)
  Top 0.254: v31.75,21.59 9.14,21.59 8.64,22.1 8.64,24.13 8.13,24.64 JSPARE.3
  Bottom 0.254: UPIC.P$2 35.25,25.34 35.05,25.15 35.05,21.84 34.8,21.59 v31.75,21.59
SPARE4  (via drill 0.6)
  Top 0.254: JSPARE.4 8.89,27.18 9.4,26.67 9.4,23.11 9.91,22.61 v29.97,22.61
  Bottom 0.254: UPIC.P$3 34.37,25.99 34.04,25.65 34.04,22.86 33.78,22.61 v29.97,22.61
SPARE5  (via drill 0.6)
  Top 0.254: v28.45,23.62 10.67,23.62 10.16,24.13 10.16,29.21 9.65,29.72 JSPARE.5
  Bottom 0.254: UPIC.P$4 33.75,26.64 33.53,26.42 33.53,23.88 33.27,23.62 v28.45,23.62
SPARE6  (via drill 0.6)
  Top 0.254: v26.67,24.64 11.43,24.64 10.92,25.15 10.92,31.75 10.41,32.26 JSPARE.6
  Bottom 0.254: UPIC.P$5 33.13,27.29 32.77,26.92 32.77,24.89 32.51,24.64 v26.67,24.64
TRANSF_N
  Top 0.61: JTRAN.3 76.2,16.51 | 76.2,16.51 JTRAN.2 76.2,14.99 74.49,13.27 Q2.4 | Q2.6 72.67,16.29 72.9,16.51 76.2,16.51
TRANSF_P
  Top 0.61: JTRAN.4 77.47,20.32 77.72,20.07 77.72,12.95 77.47,12.7 JTRAN.1 | Q1.4 74.49,18.35 76.2,20.07 JTRAN.4 | Q1.6 72.67,21.87 72.9,22.1 75.95,22.1 76.2,21.84 JTRAN.4
USB_RX  (via drill 0.6)
  Top 0.254: v49.78,11.68 55.12,11.68 55.47,11.33 UUSB.5
  Bottom 0.254: UPIC.P$37 41.94,20.04 48.51,13.72 48.51,12.95 v49.78,11.68
USB_TX  (via drill 0.6)
  Top 0.254: v51.31,12.7 57.66,12.7 58.07,12.29 UUSB.1
  Bottom 0.254: UPIC.P$36 42.59,20.91 v51.31,12.7
USBDM  (via drill 0.6)
  Top 0.254: UUSB.16 50.27,3.54 50.8,4.06 v50.8,4.57
  Bottom 0.254: JUSB.D- 50.33,5.04 v50.8,4.57
USBDP  (via drill 0.6)
  Top 0.254: UUSB.15 49.62,4.48 v49.53,4.57
  Bottom 0.254: JUSB.D+ v49.53,4.57
VCAP
  Bottom 0.254: UPIC.P$7 30.88,28.59 30.48,28.19 30.48,26.8 CCAP.1
VDCOUPL
  Top 0.254: 24.64,66.29 CBYP_RFD3.2 24.3,66.1 URF.5
X1_OSC1
  Bottom 0.254: UPIC.P$30 47.53,26.64 48.26,25.91 48.26,22.86 48.77,22.35 X1.P$1 49.85,22.03 50.29,21.59 50.29,20.66 CX1_1.1
X1_OSC2
  Bottom 0.254: UPIC.P$31 46.65,25.99 47.24,25.4 47.24,22.61 46.99,22.35 X1.P$2 45.38,22.08 CX1_2.1
X2_OSC1
  Top 0.254: URF.8 22.35,66.29 23.88,67.82 23.88,70.17 X2.P$1 | 23.62,70.29 X2.P$1 | CX2_1.1 24.22,70.89 X2.P$1
X2_OSC2
  Top 0.254: URF.10 21.35,65.52 20.57,66.29 20.57,68.83 19.56,69.85 19.56,70.29 X2.P$2 | 19.15,70.7 X2.P$2 | 19.47,70.38 X2.P$2 | CX2_2.1 19.22,70.63 X2.P$2

### Text on the board
tPlace: Laser Beacon V3 | [BTX] Board v1.0 | Paul M. - 11/2012
tNames: RC9 | RC8 | RC7 | RC6 | RB9 | RB8 | - | +